# EasyEDA Pro project AD620.eprj

# Schematic Schematic1
Create Date: 2022-11-04; Page Name: P1; Project Name: AD620; Schematic Name: Schematic1; Update Date: 2022-11-04
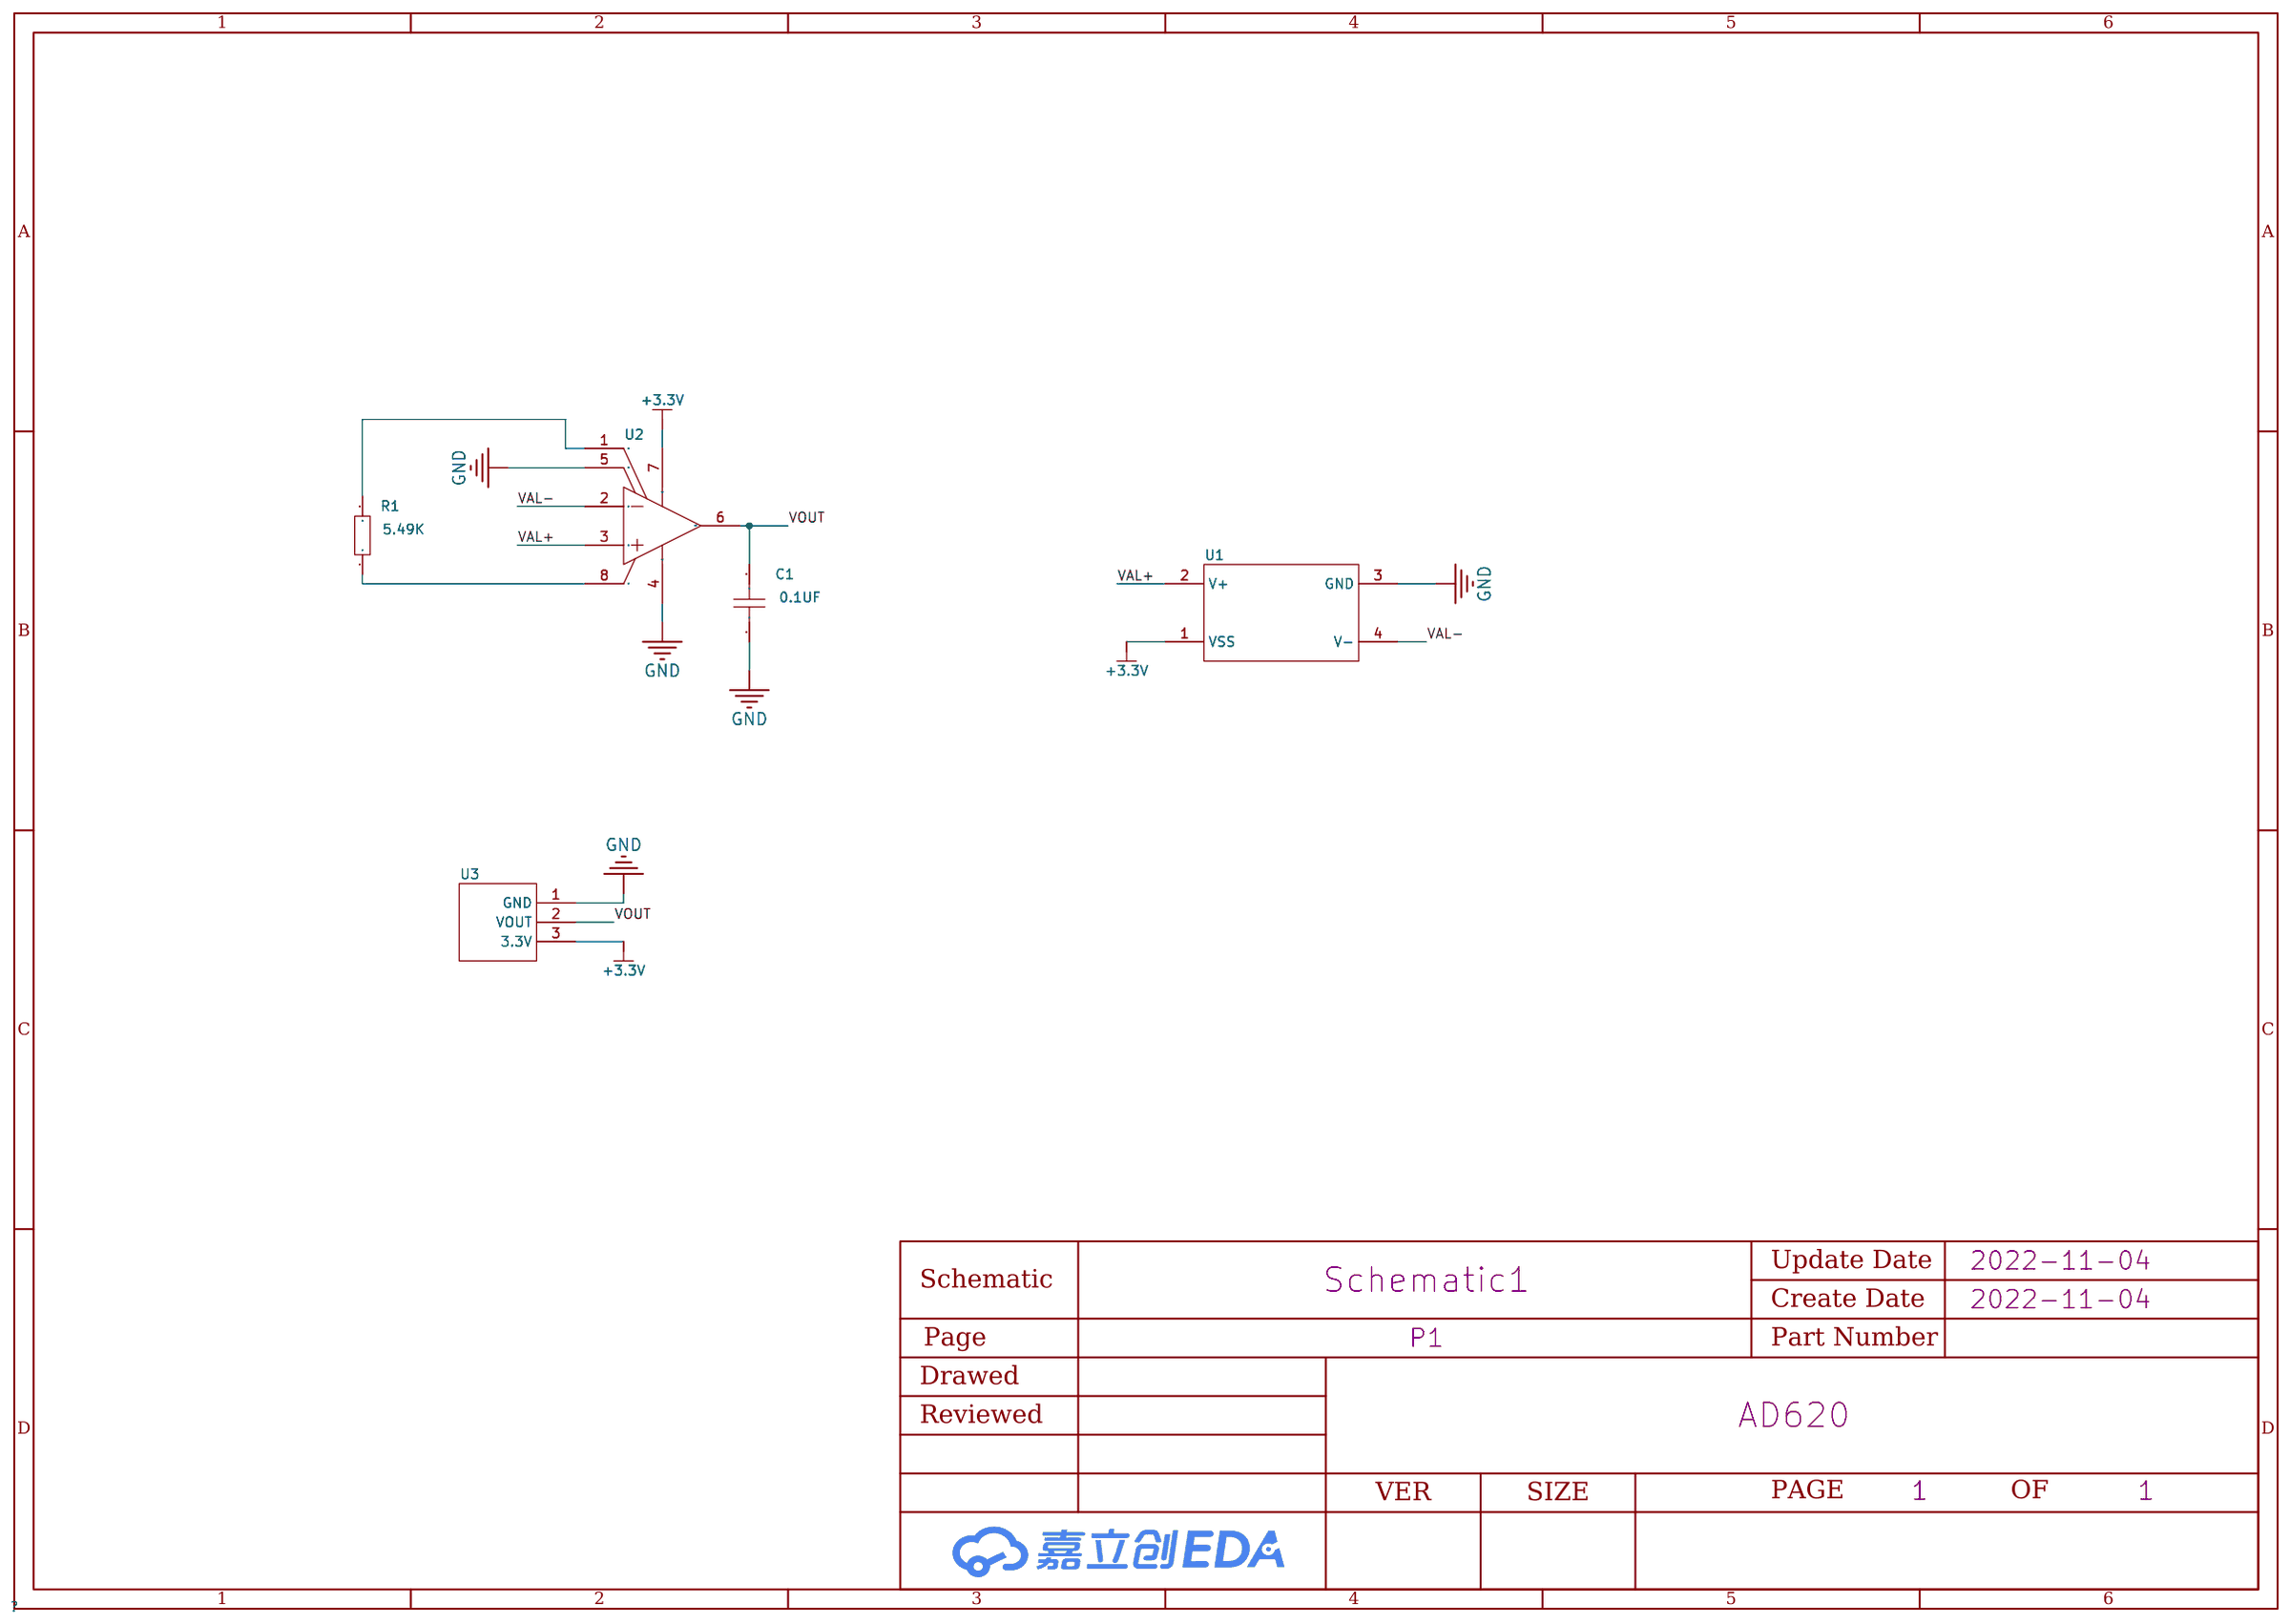
[diagram p0: schematic sheet]

## Parts
C1  0.1UF  [C0603]
R1  5.49K  [R0603]
U1  -  [FSS1500]
U2  AD620ARZ  [SOIC-8_L4.9-W3.9-P1.27-LS6.0-BL]
U3  -  [3POINT]

## Library data of the parts
C1 = CC0603KRX7R9BB104: 容值:100nF;精度:±10%;额定电压:50V;材质(温度系数):X7R;; LCSC Part Name: 100nF ±10% 50V; Supplier Part: C14663; Manufacturer: YAGEO(国巨); Supplier Footprint: 0603; JLCPCB Part Class: Basic Part; Datasheet: https://atta.szlcsc.com/upload/public/pdf/source/20170116/1484561234239.pdf; Supplier: LCSC; Tolerance: ±10%; Voltage Rated: 50V; Temperature Coefficient: X7R
R1 = 0603WAF1002T5E: 电阻类型:厚膜电阻;阻值:10kΩ;精度:±1%;功率:100mW;温度系数:±100ppm/;最大工作电压:75V;工作温度范围:-55~+155;; LCSC Part Name: 10kΩ ±1% 100mW; Supplier Part: C25804; Manufacturer: UNI-ROYAL(厚声); Supplier Footprint: 0603; JLCPCB Part Class: Basic Part; Datasheet: https://atta.szlcsc.com/upload/public/pdf/source/20200306/C422600_1E6D84923E4A46A82E41ADD87F860B5C.pdf; Supplier: LCSC; Type: 厚膜电阻; Tolerance: ±1%; Power(Watts): 100mW; Temperature Coefficient: ±100ppm/; Overload Voltage (Max): 75V; Operating Temperature Range: -55~+155
U1 = FSS1500
U2 = AD620ARZ: 运放类型:-;放大器组数:-;增益带宽积（GBP）:-;压摆率（SR）:-;电源电压:-;各通道供电电流:-;; Supplier Part: C578332; Manufacturer: ADI(亚德诺)/LINEAR; Supplier Footprint: SOIC-8; JLCPCB Part Class: Extended Part; Datasheet: https://atta.szlcsc.com/upload/public/pdf/source/20190712/C392899_954E4CF05BC1DA3D78A99C9B802C8C83.pdf; Supplier: LCSC
U3 = 3POINT

## Nets
+3.3V: U1.1(VSS) U2.7(+VS) U3.3(3.3V)
GND: C1.1 U1.3(GND) U2.4(–VS) U2.5(REF) U3.1(GND)
VAL+: U1.2(V+) U2.3(IN+)
VAL-: U1.4(V-) U2.2(IN-)
VOUT: C1.2 U2.6(OUTPUT) U3.2(VOUT)
$1N649: R1.2 U2.1(RG)
$1N658: R1.1 U2.8(RG)

# Board PCB1
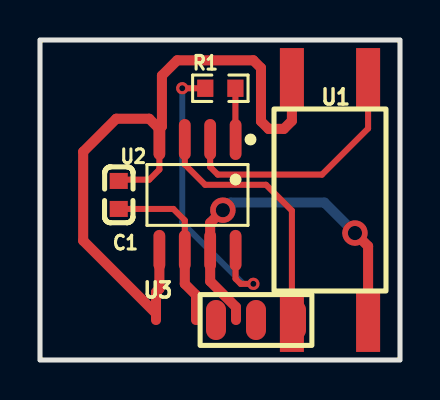
[diagram p1: board, top side]
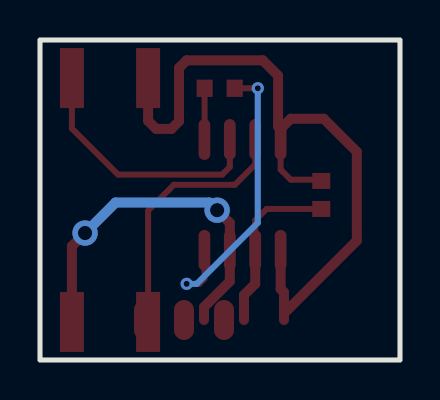
[diagram p2: board, bottom side, seen from below]

Outline 18 x 16 mm; copper layers: Top Layer, Bottom Layer. Coordinates in mm from the lower left corner of the outline.
Outline path: rectangle 0,16 18,0
Stack: Top Layer 0.035mm / Dielectric1 1.51mm FR4 er 4.5 / Bottom Layer 0.035mm

## Design rules (mm)
spacing safeClearance (default): track to track 0.152, other pairs 0.152 to 0.3
track width trackWidth (default): min 0.127, default 0.254, max 2.54
differential pair differentialPair (default): width min 0.127, default 0.254, max 2.54; gap min 0.152, default 0.152
via viaSize (default): diameter min 0.5, default 0.61, max 10; hole min 0.3, default 0.305, max 6

## Placement (name value [footprint] x y rotation side)
C1  0.1UF  [C0603]  3.94 8.25 270 top
R1  5.49K  [R0603]  9.02 13.59 0 top
U1  -  [FSS1500]  14.5 8 90 top
U2  AD620ARZ  [SOIC-8_L4.9-W3.9-P1.27-LS6.0-BL]  7.87 8.25 180 top
U3  -  [3POINT]  7.8 2 0 top

## Footprints (pads in the part's own frame, mm; a bottom-side part is the same pattern mirrored in y, then rotated)
3POINT
  oval 1x2 smd: 1(1,0) 2(3,0) 3(5,0)
C0603
  rect 0.8x0.9 smd: 1(-0.7,0) 2(0.7,0)
FSS1500
  rect 3x1.2 smd: 1(-6.096,-1.905) 2(-6.096,1.905) 3(6.096,1.905) 4(6.096,-1.905)
R0603
  rect 0.806x0.864 smd: 1(-0.753,0) 2(0.753,0)
SOIC-8_L4.9-W3.9-P1.27-LS6.0-BL
  oval 0.588x2.045 smd: 1(-1.905,-2.772) 2(-0.635,-2.772) 3(0.635,-2.772) 4(1.905,-2.772) 5(1.905,2.772) 6(0.635,2.772) 7(-0.635,2.772) 8(-1.905,2.772)

## Nets
As in the schematic.

## Via types
v1: diameter 1.27, hole 0.711, Top Layer to Bottom Layer, 2 vias
v2: diameter 0.61, hole 0.305, Top Layer to Bottom Layer, 2 vias

## Routing (per net, layer and track width the routed paths; a pad name or vN(x,y) marks a point on that pad's centre or on a via; arc(x,y) is an arc through that point)
+3.3V: length 18.4
  Top Layer w0.5: 9.8,2 9.8,2.64 8.51,3.94 U2.7 8.51,6.86 v1(9.14,7.49) ; U1.1 16.41,5.69 v1(15.75,6.35)
  Bottom Layer w0.5: v1(15.75,6.35) 14.22,7.87 9.53,7.87 v1(9.14,7.49)
GND: length 37
  Top Layer w0.3: C1.1 4,9.02 5.46,9.02 5.97,9.52 U2.4
  Top Layer w0.5: 5.8,2 5.8,2.33 ; 5.8,2.33 2.16,5.97 2.16,10.41 3.81,12.06 5.46,12.06 5.97,11.56 ; 5.8,2.33 5.8,3.39 5.97,3.55 U2.5 ; 5.97,11.56 6.1,11.68 6.1,14.22 6.86,14.98 10.67,14.98 11.05,14.6 11.05,11.94 11.43,11.56 12.19,11.56 12.59,11.96 U1.3 ; 5.97,11.56 U2.4
VAL+: length 13.1
  Top Layer w0.3: U1.2 12.59,7.47 11.3,8.76 8.25,8.76 7.24,9.78 U2.3
VAL-: length 12.9
  Top Layer w0.3: U1.4 16.41,11.58 14.1,9.27 8.89,9.27 8.51,9.65 U2.2
VOUT: length 8.8
  Top Layer w0.3: U2.6 7.24,6.98 6.67,7.55 C1.2
  Top Layer w0.5: U2.6 7.24,3.81 7.8,3.25 7.8,2
$1N649: length 2.6
  Top Layer w0.3: U2.1 9.77,11.03 R1.2
$1N658: length 15.1
  Top Layer w0.3: R1.1 v2(7.11,13.59) ; U2.8 9.78,4.06 10.03,3.81 v2(10.67,3.81)
  Bottom Layer w0.3: v2(7.11,13.59) 7.11,6.86 10.16,3.81 v2(10.67,3.81)

## Copper pours and planes (outline as drawn; the poured copper is in the pictures)
GND on Top Layer: 0,16 18,16 18,0 0,0
GND on Bottom Layer: 0,16 18,16 18,0 0,0
